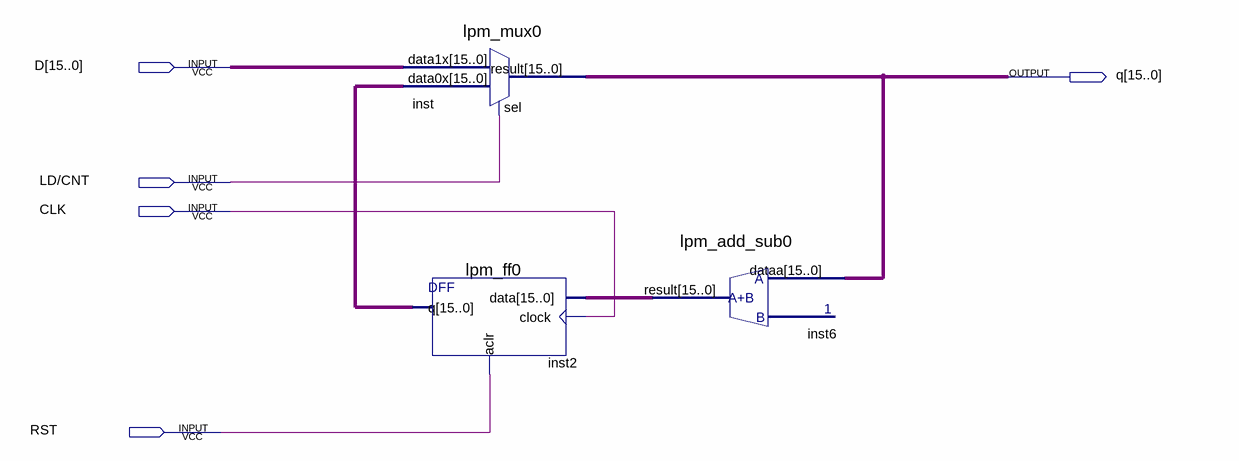
[diagram p0: schematic sheet]
// Quartus schematic lab2.bdf as structural Verilog: 3 symbols, 5 pins
module lab2 (
  input  [15:0] D,
  input  \LD/CNT ,
  input  CLK,
  input  RST,
  output [15:0] q
);

  wire [15:0] inst2_q, inst6_result;

  lpm_mux0 inst (.data1x(D), .data0x(inst2_q), .sel(\LD/CNT ), .result(q));
  lpm_ff0 inst2 (.data(inst6_result), .clock(CLK), .aclr(RST), .q(inst2_q));
  lpm_add_sub0 inst6 (.dataa(q), .result(inst6_result));
endmodule
